# Altium schematic sheet LDOs.SchDoc
size A; SheetNumber: 5; SheetTotal: 4
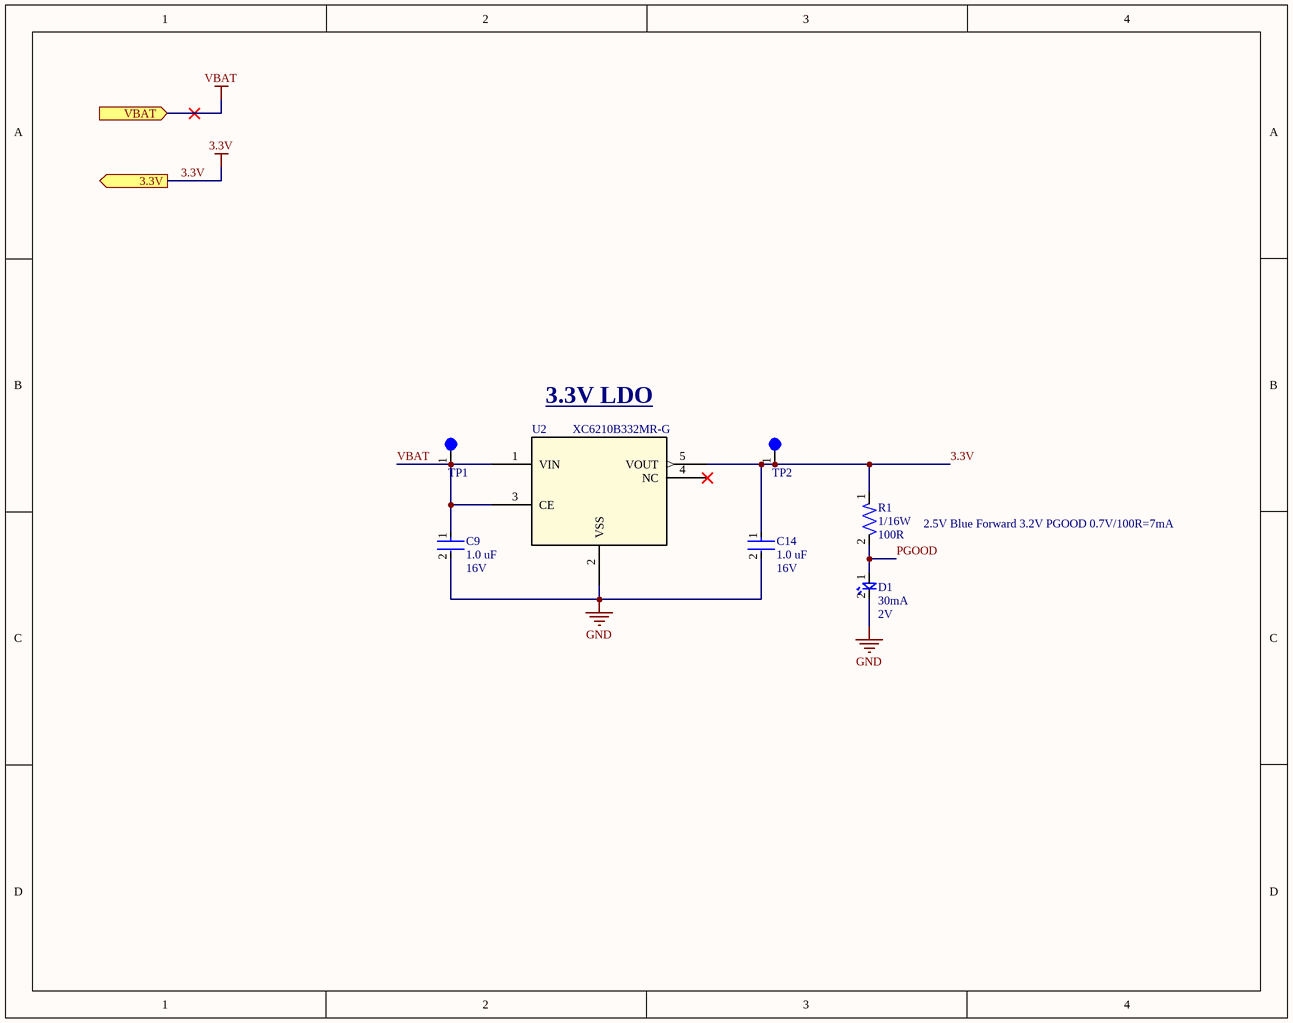
[diagram p0: LDOs.SchDoc]

## Parts
C9  Capacitance: 1.0 uF  Voltage: 16V  [CAP-0603]  (hidden comment: CC0603KRX7R7BB105)
C14  Capacitance: 1.0 uF  Voltage: 16V  [CAP-0603]  (hidden comment: CC0603KRX7R7BB105)
D1  Forward Current: 30mA  Forward Voltage: 2V  [LED-0603]  (hidden comment: BL-HKC36G-AV-TRB)
R1  Power: 1/16W  Resistance: 100R  [RES-0402]  (hidden comment: RC0402FR-07100RL)
TP1  5003  [TEST-POINT-0001]  (value not drawn)
TP2  5003  [TEST-POINT-0001]  (value not drawn)
U2  XC6210B332MR-G  [SOT-25_TOR]

## Ports
3.3V (out, see TLD[2A], Connectors[4D], MCU[4D]), VBAT (in, see TLD[1A], Connectors[3A])

## Nets
3.3V: C14.1 R1.1 TP2.1 U2.5(VOUT) ; port 3.3V
GND: C9.2 C14.2 D1.2 U2.2(VSS)
VBAT: C9.1 TP1.1 U2.1(VIN) U2.3(CE) ; port VBAT
PGOOD: D1.1 R1.2

Not connected (* = marked no-connect by the designer): U2 4(NC)*

## Notes on the sheet
- 3.3V LDO
- 2.5V Blue Forward 3.2V PGOOD 0.7V/100R=7mA

## Library data of the parts
C9 C14 = CAP-1U-0002: CAP CER 1UF 16V X7R 0603; Device Class: Ceramic; Size: 0603
D1 = LED-0001: LED YELLOW CLEAR 0603 SMD; ComponentLink1Description: Datasheet; ComponentLink1URL: https://www.americanbrightled.com/pdffiles/led-components/smt/BL-HKC36G-AV-TRB.pdf
R1 = RES-100-0001: RES 100 OHM 1% 1/16W 0402; Tolerance: 1%; Size: 0402; ComponentLink1Description: Datasheet; ComponentLink1URL: https://www.yageo.com/upload/media/product/products/datasheet/rchip/PYu-RC_Group_51_RoHS_L_12.pdf
TP1 TP2 = TEST-POINT-0001: Oranange PC Test Point, Miniature Phoisphor Bronze Silver Plating Through Hole Mounting Type
U2 = LDO-3.3V_1: Linear Voltage Regulator IC Positive Fixed 1 Output 700mA SOT-25-5; Mfr_Name: Torex Semiconductor; RefDes: RefDes; Type: Type; ComponentLink1Description: Datasheet; ComponentLink1URL: https://product.torexsemi.com/system/files/series/xc6210.pdf